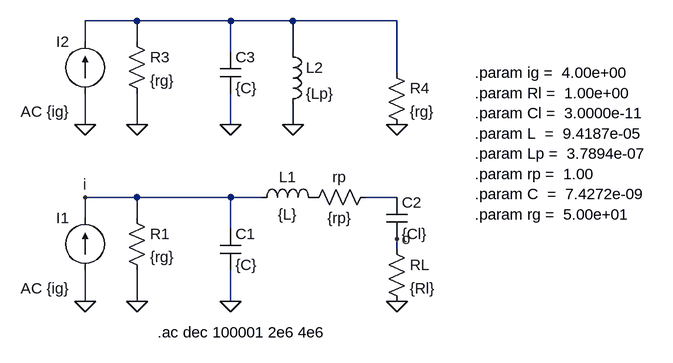
[diagram p0: schematic adaptadorL_ejemplo2.asc]
adaptadorL_ejemplo2.asc, the LTspice schematic file:
Version 4
SHEET 1 968 680
WIRE 80 -160 0 -160
WIRE 224 -160 80 -160
WIRE 320 -160 224 -160
WIRE 480 -160 320 -160
WIRE 0 -128 0 -160
WIRE 80 -128 80 -160
WIRE 224 -112 224 -160
WIRE 320 -112 320 -160
WIRE 480 -80 480 -160
WIRE 0 0 0 -48
WIRE 80 0 80 -48
WIRE 224 0 224 -48
WIRE 320 0 320 -32
WIRE 80 112 0 112
WIRE 224 112 80 112
WIRE 272 112 224 112
WIRE 480 112 432 112
WIRE 0 144 0 112
WIRE 80 144 80 112
WIRE 224 160 224 112
WIRE 480 192 480 176
WIRE 0 272 0 224
WIRE 80 272 80 224
WIRE 224 272 224 224
FLAG 480 272 0
FLAG 224 272 0
FLAG 80 272 0
FLAG 0 272 0
FLAG 480 0 0
FLAG 224 0 0
FLAG 80 0 0
FLAG 0 0 0
FLAG 320 0 0
FLAG 0 112 i
FLAG 480 176 o
SYMBOL current 0 224 R180
WINDOW 0 24 80 Left 2
WINDOW 3 24 0 Left 2
WINDOW 123 24 -28 Left 2
WINDOW 39 0 0 Left 0
SYMATTR InstName I1
SYMATTR Value ""
SYMATTR Value2 AC {ig}
SYMBOL res 64 128 R0
SYMATTR InstName R1
SYMATTR Value {rg}
SYMBOL cap 208 160 R0
SYMATTR InstName C1
SYMATTR Value {C}
SYMATTR SpiceLine Rser=0
SYMBOL ind 256 128 R270
WINDOW 0 32 56 VTop 2
WINDOW 3 5 56 VBottom 2
SYMATTR InstName L1
SYMATTR Value {L}
SYMATTR SpiceLine Rser=0
SYMBOL res 464 176 R0
SYMATTR InstName RL
SYMATTR Value {Rl}
SYMBOL cap 464 112 R0
SYMATTR InstName C2
SYMATTR Value {Cl}
SYMBOL res 448 96 R90
WINDOW 0 0 56 VBottom 2
WINDOW 3 32 56 VTop 2
SYMATTR InstName rp
SYMATTR Value {rp}
SYMBOL current 0 -48 R180
WINDOW 0 24 80 Left 2
WINDOW 3 24 0 Left 2
WINDOW 123 24 -28 Left 2
WINDOW 39 0 0 Left 0
SYMATTR InstName I2
SYMATTR Value ""
SYMATTR Value2 AC {ig}
SYMBOL res 64 -144 R0
SYMATTR InstName R3
SYMATTR Value {rg}
SYMBOL cap 208 -112 R0
SYMATTR InstName C3
SYMATTR Value {C}
SYMATTR SpiceLine Rser=0
SYMBOL res 464 -96 R0
SYMATTR InstName R4
SYMATTR Value {rg}
SYMBOL ind 304 -128 R0
SYMATTR InstName L2
SYMATTR Value {Lp}
TEXT 112 320 Left 2 !.ac dec 100001 2e6 4e6
TEXT 600 -80 Left 2 !.param ig =  4.00e+00 \n.param Rl =  1.00e+00 \n.param Cl =  3.0000e-11 \n.param L  =  9.4187e-05 \n.param Lp =  3.7894e-07 \n.param rp =  1.00 \n.param C  =  7.4272e-09 \n.param rg =  5.00e+01

The netlist it stands for:
* adaptadorL_ejemplo2.asc
I1 0 i AC {ig}
R1 i 0 {rg}
C1 i 0 {C} Rser=0
L1 i P001 {L} Rser=0
RL o 0 {Rl}
C2 N002 o {Cl}
rp N002 P001 {rp}
I2 0 N001 AC {ig}
R3 N001 0 {rg}
C3 N001 0 {C} Rser=0
R4 N001 0 {rg}
L2 N001 0 {Lp}
.ac dec 100001 2e6 4e6
.param ig =  4.00e+00
.param Rl =  1.00e+00
.param Cl =  3.0000e-11
.param L  =  9.4187e-05
.param Lp =  3.7894e-07
.param rp =  1.00
.param C  =  7.4272e-09
.param rg =  5.00e+01
.backanno
.end